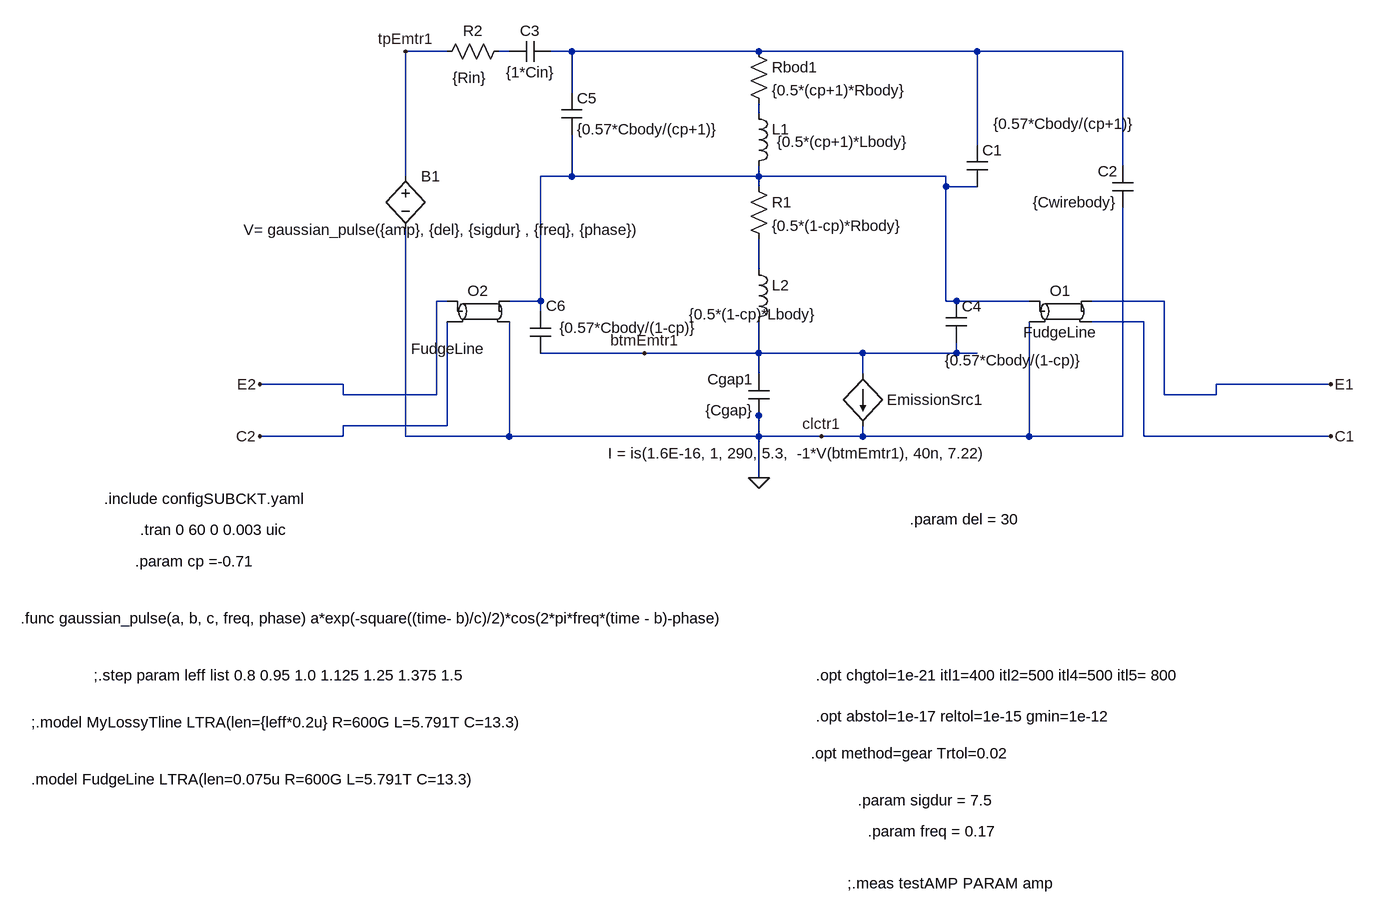
[diagram p0: schematic SingleAntennaOpenLeads.asc]
SingleAntennaOpenLeads.asc, the LTspice schematic file:
Version 4.1
SHEET 1 1016 752
WIRE -400 -544 -464 -544
WIRE -304 -544 -320 -544
WIRE -208 -544 -240 -544
WIRE 80 -544 -208 -544
WIRE 416 -544 80 -544
WIRE 640 -544 416 -544
WIRE -208 -480 -208 -544
WIRE 80 -448 80 -464
WIRE 416 -400 416 -544
WIRE 640 -368 640 -544
WIRE -464 -352 -464 -544
WIRE -208 -352 -208 -416
WIRE -208 -352 -256 -352
WIRE 80 -352 80 -368
WIRE 80 -352 -208 -352
WIRE 368 -352 80 -352
WIRE 80 -336 80 -352
WIRE 368 -336 368 -352
WIRE 416 -336 368 -336
WIRE 80 -208 80 -256
WIRE -400 -160 -416 -160
WIRE -256 -160 -256 -352
WIRE -256 -160 -304 -160
WIRE 368 -160 368 -336
WIRE 384 -160 368 -160
WIRE 496 -160 384 -160
WIRE 704 -160 592 -160
WIRE -256 -144 -256 -160
WIRE 672 -128 592 -128
WIRE -96 -80 -256 -80
WIRE 80 -80 80 -128
WIRE 80 -80 -96 -80
WIRE 240 -80 80 -80
WIRE 384 -80 384 -96
WIRE 384 -80 240 -80
WIRE 416 -80 384 -80
WIRE 80 -48 80 -80
WIRE 240 -48 240 -80
WIRE -560 -32 -688 -32
WIRE 960 -32 784 -32
WIRE -560 -16 -560 -32
WIRE -416 -16 -416 -160
WIRE -416 -16 -560 -16
WIRE 704 -16 704 -160
WIRE 784 -16 784 -32
WIRE 784 -16 704 -16
WIRE 80 16 80 0
WIRE -400 32 -400 -128
WIRE -400 32 -560 32
WIRE -560 48 -560 32
WIRE -560 48 -688 48
WIRE -464 48 -464 -272
WIRE -304 48 -304 -128
WIRE -304 48 -464 48
WIRE 80 48 80 16
WIRE 80 48 -304 48
WIRE 176 48 80 48
WIRE 240 48 240 32
WIRE 240 48 176 48
WIRE 496 48 496 -128
WIRE 496 48 240 48
WIRE 640 48 640 -304
WIRE 640 48 496 48
WIRE 672 48 672 -128
WIRE 960 48 672 48
WIRE 80 112 80 48
FLAG -96 -80 btmEmtr1
FLAG 176 48 clctr1
FLAG -464 -544 tpEmtr1
FLAG 80 112 0
FLAG -688 -32 E2
FLAG -688 48 C2
FLAG 960 -32 E1
FLAG 960 48 C1
SYMBOL cap 400 -400 R0
WINDOW 3 41 -33 Left 2
SYMATTR Value {0.57*Cbody/(cp+1)}
SYMATTR InstName C1
SYMBOL cap 96 16 R180
WINDOW 0 24 56 Left 2
WINDOW 3 24 8 Left 2
SYMATTR InstName Cgap1
SYMATTR Value {Cgap}
SYMBOL cap 656 -304 R180
WINDOW 0 24 56 Left 2
WINDOW 3 24 8 Left 2
SYMATTR InstName C2
SYMATTR Value {Cwirebody}
SYMBOL res 64 -560 R0
SYMATTR InstName Rbod1
SYMATTR Value {0.5*(cp+1)*Rbody}
SYMBOL res 64 -352 R0
SYMATTR InstName R1
SYMATTR Value {0.5*(1-cp)*Rbody}
SYMBOL ind 64 -464 R0
WINDOW 3 44 59 Left 2
SYMATTR Value {0.5*(cp+1)*Lbody}
SYMATTR InstName L1
SYMBOL ind 64 -224 R0
WINDOW 3 -92 84 Left 2
SYMATTR Value {0.5*(1-cp)*Lbody}
SYMATTR InstName L2
SYMBOL res -304 -560 R90
WINDOW 0 0 56 VBottom 2
WINDOW 3 41 61 VTop 2
SYMATTR InstName R2
SYMATTR Value {Rin}
SYMBOL cap -240 -560 R90
WINDOW 0 0 32 VBottom 2
WINDOW 3 32 32 VTop 2
SYMATTR InstName C3
SYMATTR Value {1*Cin}
SYMBOL cap 368 -160 R0
WINDOW 3 -2 91 Left 2
SYMATTR Value {0.57*Cbody/(1-cp)}
SYMATTR InstName C4
SYMBOL cap -224 -480 R0
SYMATTR InstName C5
SYMATTR Value {0.57*Cbody/(cp+1)}
SYMBOL cap -272 -144 R0
WINDOW 0 24 -9 Left 2
WINDOW 3 45 25 Left 2
SYMATTR InstName C6
SYMATTR Value {0.57*Cbody/(1-cp)}
SYMBOL ltline 544 -144 R0
SYMATTR InstName O1
SYMATTR Value FudgeLine
SYMBOL ltline -352 -144 R0
WINDOW 3 -46 42 Top 2
SYMATTR Value FudgeLine
SYMATTR InstName O2
SYMBOL bv -464 -368 R0
WINDOW 3 -249 98 Left 2
SYMATTR Value V= gaussian_pulse({amp}, {del}, {sigdur} , {freq}, {phase})
SYMATTR InstName B1
SYMBOL bi 240 -48 R0
WINDOW 3 -392 122 Left 2
WINDOW 0 37 40 Left 2
SYMATTR Value I = is(1.6E-16, 1, 290, 5.3,  -1*V(btmEmtr1), 40n, 7.22)
SYMATTR InstName EmissionSrc1
TEXT -928 144 Left 2 !.include configSUBCKT.yaml
TEXT -872 192 Left 2 !.tran 0 60 0 0.003 uic
TEXT -880 240 Left 2 !.param cp =-0.71
TEXT -944 416 Left 2 !;.step param leff list 0.8 0.95 1.0 1.125 1.25 1.375 1.5
TEXT -1056 328 Left 2 !.func gaussian_pulse(a, b, c, freq, phase) a*exp(-square((time- b)/c)/2)*cos(2*pi*freq*(time - b)-phase)
TEXT 312 176 Left 2 !.param del = 30
TEXT 160 536 Left 2 !.opt method=gear Trtol=0.02
TEXT 232 608 Left 2 !.param sigdur = 7.5
TEXT 248 656 Left 2 !.param freq = 0.17
TEXT -1040 488 Left 2 !;.model MyLossyTline LTRA(len={leff*0.2u} R=600G L=5.791T C=13.3)
TEXT -1040 576 Left 2 !.model FudgeLine LTRA(len=0.075u R=600G L=5.791T C=13.3)
TEXT 168 416 Left 2 !.opt chgtol=1e-21 itl1=400 itl2=500 itl4=500 itl5= 800\n \n.opt abstol=1e-17 reltol=1e-15 gmin=1e-12
TEXT 216 736 Left 2 !;.meas testAMP PARAM amp

The netlist it stands for:
* SingleAntennaOpenLeads.asc
C1 N002 N004 {0.57*Cbody/(cp+1)}
Cgap1 0 btmEmtr1 {Cgap}
C2 0 N002 {Cwirebody}
Rbod1 N002 N003 {0.5*(cp+1)*Rbody}
R1 N004 N005 {0.5*(1-cp)*Rbody}
L1 N003 N004 {0.5*(cp+1)*Lbody}
L2 N005 btmEmtr1 {0.5*(1-cp)*Lbody}
R2 N001 tpEmtr1 {Rin}
C3 N002 N001 {1*Cin}
C4 N004 btmEmtr1 {0.57*Cbody/(1-cp)}
C5 N002 N004 {0.57*Cbody/(cp+1)}
C6 N004 btmEmtr1 {0.57*Cbody/(1-cp)}
O1 N004 0 E1 C1 FudgeLine
O2 E2 C2 N004 0 FudgeLine
B1 tpEmtr1 0 V= gaussian_pulse({amp}, {del}, {sigdur} , {freq}, {phase})
B§EmissionSrc1 btmEmtr1 0 I = is(1.6E-16, 1, 290, 5.3,  -1*V(btmEmtr1), 40n, 7.22)
.include configSUBCKT.yaml
.tran 0 60 0 0.003 uic
.param cp =-0.71
;.step param leff list 0.8 0.95 1.0 1.125 1.25 1.375 1.5
.func gaussian_pulse(a, b, c, freq, phase) a*exp(-square((time- b)/c)/2)*cos(2*pi*freq*(time - b)-phase)
.param del = 30
.opt method=gear Trtol=0.02
.param sigdur = 7.5
.param freq = 0.17
;.model MyLossyTline LTRA(len={leff*0.2u} R=600G L=5.791T C=13.3)
.model FudgeLine LTRA(len=0.075u R=600G L=5.791T C=13.3)
.opt chgtol=1e-21 itl1=400 itl2=500 itl4=500 itl5= 800
.opt abstol=1e-17 reltol=1e-15 gmin=1e-12
;.meas testAMP PARAM amp
.backanno
.end